# EAGLE design main (EAGLE 9.6.2)
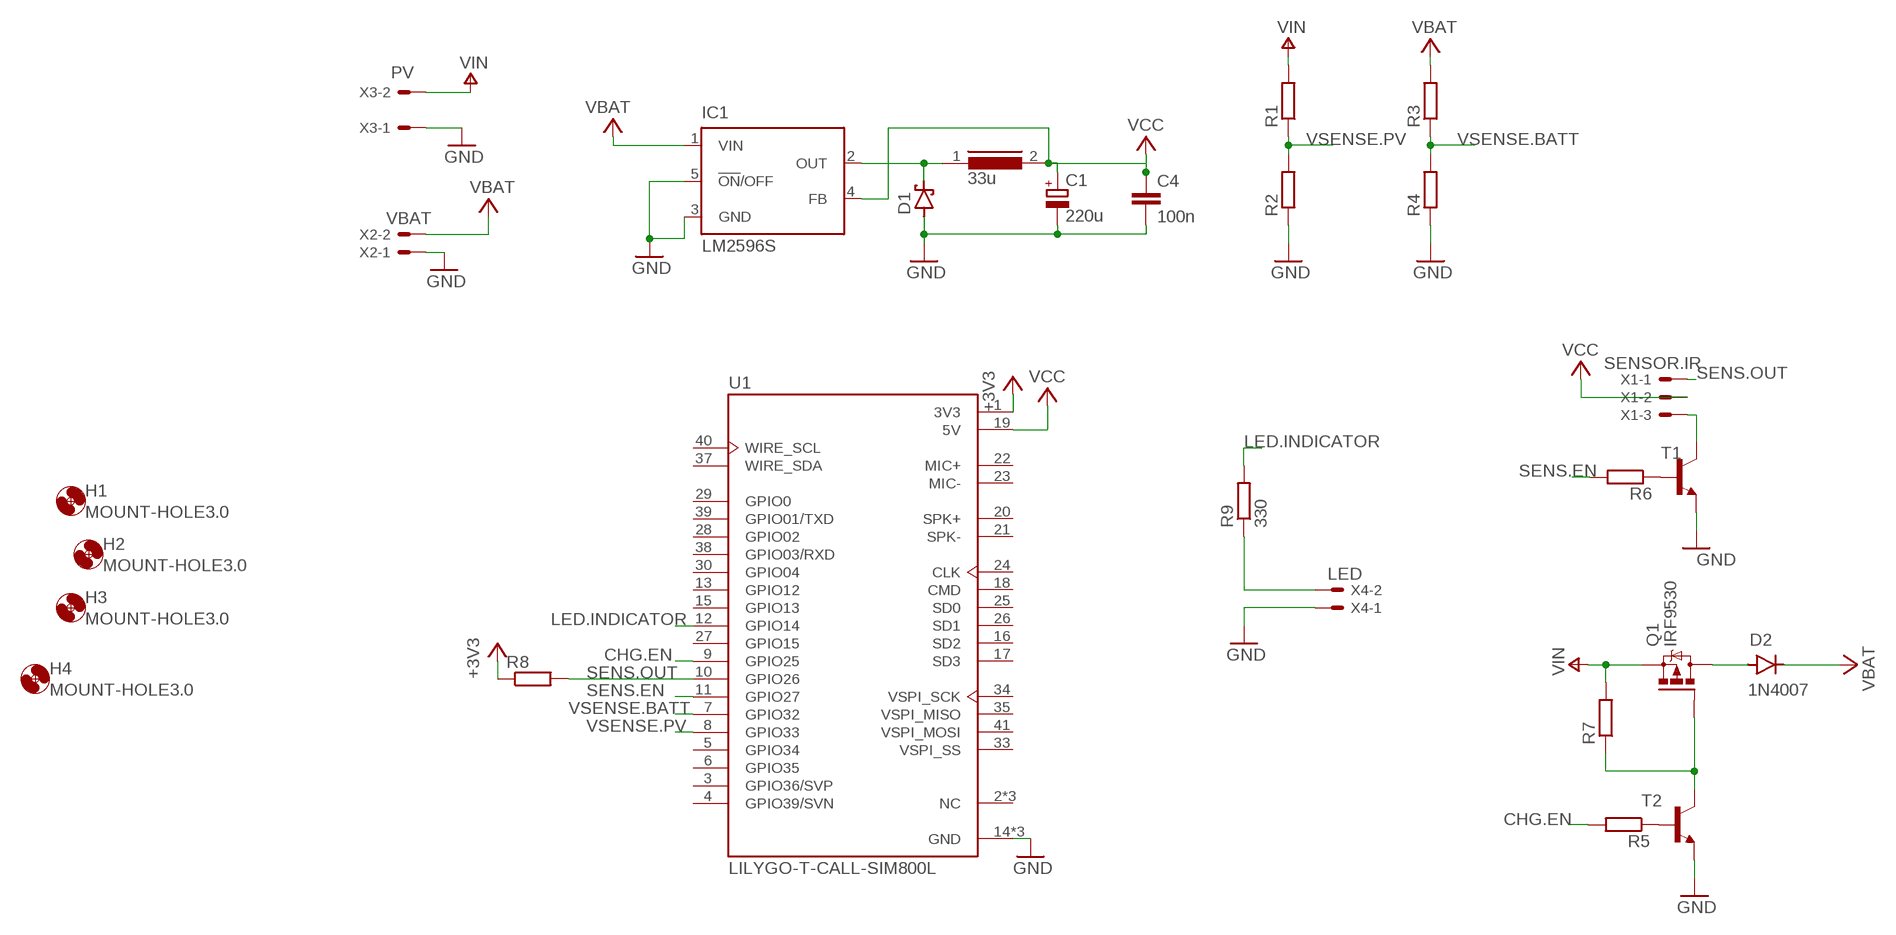
[diagram p0: schematic, sheet 1]

## Parts
C1  220u  CPOL-EU153CLV-0810  [153CLV-0810]
C4  100n  C-EUC0805  [C0805]
D1  SCHOTTKY-DIODESMD  [SMB]
D2  1N4007  [DO-41]
H1  MOUNT-HOLE3.0  [3,0]
H2  MOUNT-HOLE3.0  [3,0]
H3  MOUNT-HOLE3.0  [3,0]
H4  MOUNT-HOLE3.0  [3,0]
IC1  LM2596S  [TO263-5]
L2  33u  DR125  [DR125]
Q1  IRF9530  [TO220BV]
R1  R-EU_R0805  [R0805]
R2  R-EU_R0805  [R0805]
R3  R-EU_R0805  [R0805]
R4  R-EU_R0805  [R0805]
R5  R-EU_0207/7  [0207/7]
R6  R-EU_0207/7  [0207/7]
R7  R-EU_0207/7  [0207/7]
R8  R-EU_R0805  [R0805]
R9  330  R-EU_R0805  [R0805]
T1  -NPN-TO92-ECB  [TO92-ECB]
T2  -NPN-TO92-ECB  [TO92-ECB]
U1  LILYGO-T-CALL-SIM800L  [XCVR_LILYGO-T-CALL-SIM800L]
X1  SENSOR.IR  JST-XH-03-PIN-LONG-PAD  [JST-XH-03-PACKAGE-LONG-PAD]
X2  VBAT  JST-XH-02-PIN-LONG-PAD  [JST-XH-02-PACKAGE-LONG-PAD]
X3  PV  KK-156-2  [KK-156-2]
X4  LED  JST-XH-02-PIN-LONG-PAD  [JST-XH-02-PACKAGE-LONG-PAD]

## Nets
+3V3: R8.1 U1.1(3V3)
+5V: D2.C IC1.1(VIN) R3.2 X2.2 ; supply symbol labelled VBAT
CHG.EN: R5.2 U1.9(GPIO25)
GND: C1.- C4.2 D1.A IC1.3(GND) IC1.5(!ON!/OFF) R2.1 R4.1 T1.E T2.E U1.14(GND) U1.36(GND) U1.42(GND) X2.1 X3.1 X4.1
LED.INDICATOR: R9.2 U1.12(GPIO14)
N$4: T1.C X1.3
N$5: R6.1 T1.B
N$8: R9.1 X4.2
N$9: D1.C IC1.2(OUT) L2.1
N$14: Q1.G R7.1 T2.C
N$19: D2.A Q1.D
N$20: R5.1 T2.B
SENS.EN: R6.2 U1.11(GPIO27)
SENS.OUT: R8.2 U1.10(GPIO26) X1.1
V+: Q1.S R1.2 R7.2 X3.2 ; supply symbol labelled VIN
VCC: C1.+ C4.1 IC1.4(FB) L2.2 U1.19(5V) X1.2
VSENSE.BATT: R3.1 R4.2 U1.7(GPIO32)
VSENSE.PV: R1.1 R2.2 U1.8(GPIO33)
Unconnected: U1.3(GPIO36/SVP) U1.4(GPIO39/SVN) U1.5(GPIO34) U1.6(GPIO35) U1.13(GPIO12) U1.15(GPIO13) U1.16(SD2) U1.17(SD3) U1.18(CMD) U1.24(CLK) U1.25(SD0) U1.26(SD1) U1.27(GPIO15) U1.28(GPIO02) U1.29(GPIO0) U1.30(GPIO04) U1.33(VSPI_SS) U1.34(VSPI_SCK) U1.35(VSPI_MISO) U1.37(WIRE_SDA) U1.38(GPIO03/RXD) U1.39(GPIO01/TXD) U1.40(WIRE_SCL) U1.41(VSPI_MOSI)

## Power pins joined to a net without a drawn wire
MIC+: U1.22(MIC+)
MIC-: U1.23(MIC-)
NC: U1.2(NC) U1.31(NC) U1.32(NC)
SPK+: U1.20(SPK+)
SPK-: U1.21(SPK-)

## Library data of the parts
C1 = rcl:CPOL-EU: POLARIZED CAPACITOR, European symbol; SPICEPREFIX: C
C4 = rcl:C-EU: CAPACITOR, European symbol; SPICEPREFIX: C
D1 = diode:SCHOTTKY-DIODE: Schottky Diode
D2 = Diodes:1N4007: DIODE GEN PURP 1KV 1A DO41 Manufacturer's datasheet <https://www.mccsemi.com/pdf/Products/1N4001-1N4007(DO-41).pdf>; CREATED_BY: PCBLayout.com; DIGIKEY_PART_NUMBER: 1N4007MSCT-ND; MANUFACTURER: Micro Commercial Co; MPN: 1N4007; PACKAGE: DO-41
H1-H4 = holes:MOUNT-HOLE: MOUNTING HOLE with drill center marker
IC1 = national-semiconductor:LM2596: SIMPLE SWITCHER® Power Converter 150 kHz 3A Step-Down Voltage Regulator Source: http://www.national.com/ds/LM/LM2596.pdf; MF: NATIONAL SEMICONDUCTOR; MPN: LM2596S-ADJ/NOPB; OC_FARNELL: 9494367; OC_NEWARK: 41K3842
L2 = DR125:DR125: High Power Density, High Efficiency, Shielded Inductors Source: coiltronics_dr_series.pdf; SPICEPREFIX: L
Q1 = transistor-power:IRF9530: P-CHANNEL HEXFET POWER-MOS-FET Source: http://www.irf.com/product-info/datasheets/data/irf9530.pdf
R1-R9 = rcl:R-EU_: RESISTOR, European symbol; SPICEPREFIX: R
T1 T2 = transistor:*-NPN-: NPN Transistror BF959 corrected 2008.03.06
U1 = LILYGO-T-CALL-SIM800L:LILYGO-T-CALL-SIM800L: ESP32 Wireless Module GPRS Antenna SIM Card SIM800L Module Check availability <https://pricing.snapeda.com/parts/LilyGo-T-Call-SIM800L/LILYGO/view-part?ref=eda>; AVAILABILITY: Not in stock; DESCRIPTION: ESP32 Wireless Module GPRS Antenna SIM Card SIM800L Module; MF: LILYGO; MP: LilyGo-T-Call-SIM800L; PACKAGE: Package; PRICE: None
X1 = Rembrandt Electronics - JST XH Connectors v1-0-2-2-2-2:JST-XH-03-PIN: JST XH Connector 2 Pin Wire to board connector. Pitch: 2,54 mm, (0.100") Number of pins: 3 Created by Rembrandt Electronics www.rembrandtelectronics.com
X2 X4 = Rembrandt Electronics - JST XH Connectors v1-0-2-2-2-2:JST-XH-02-PIN: JST XH Connector 2 Pin Wire to board connector. Pitch: 2,54 mm, (0.100") Number of pins: 2 Created by Rembrandt Electronics www.rembrandtelectronics.com
X3 = con-molex:KK-156-2: KK 156 HEADER Source: http://www.molex.com/pdm_docs/sd/026604100_sd.pdf; MF: MOLEX; OC_FARNELL: unknown; OC_NEWARK: unknown

## Board
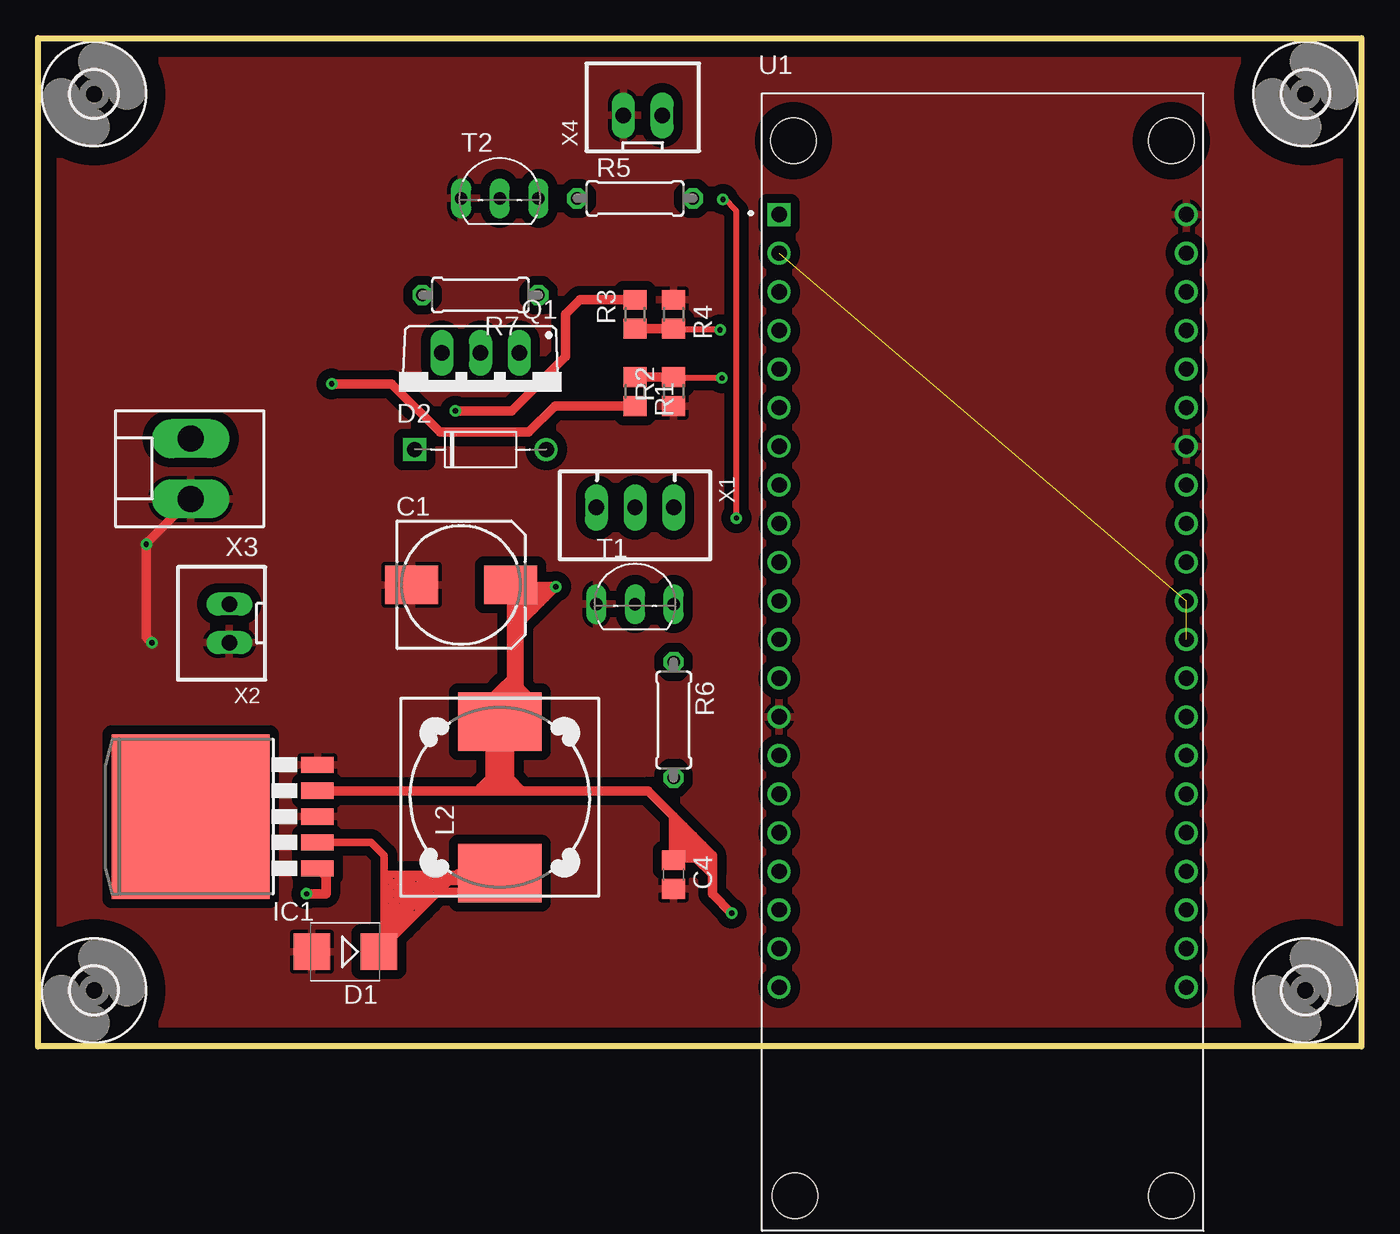
[diagram p1: board, top side]
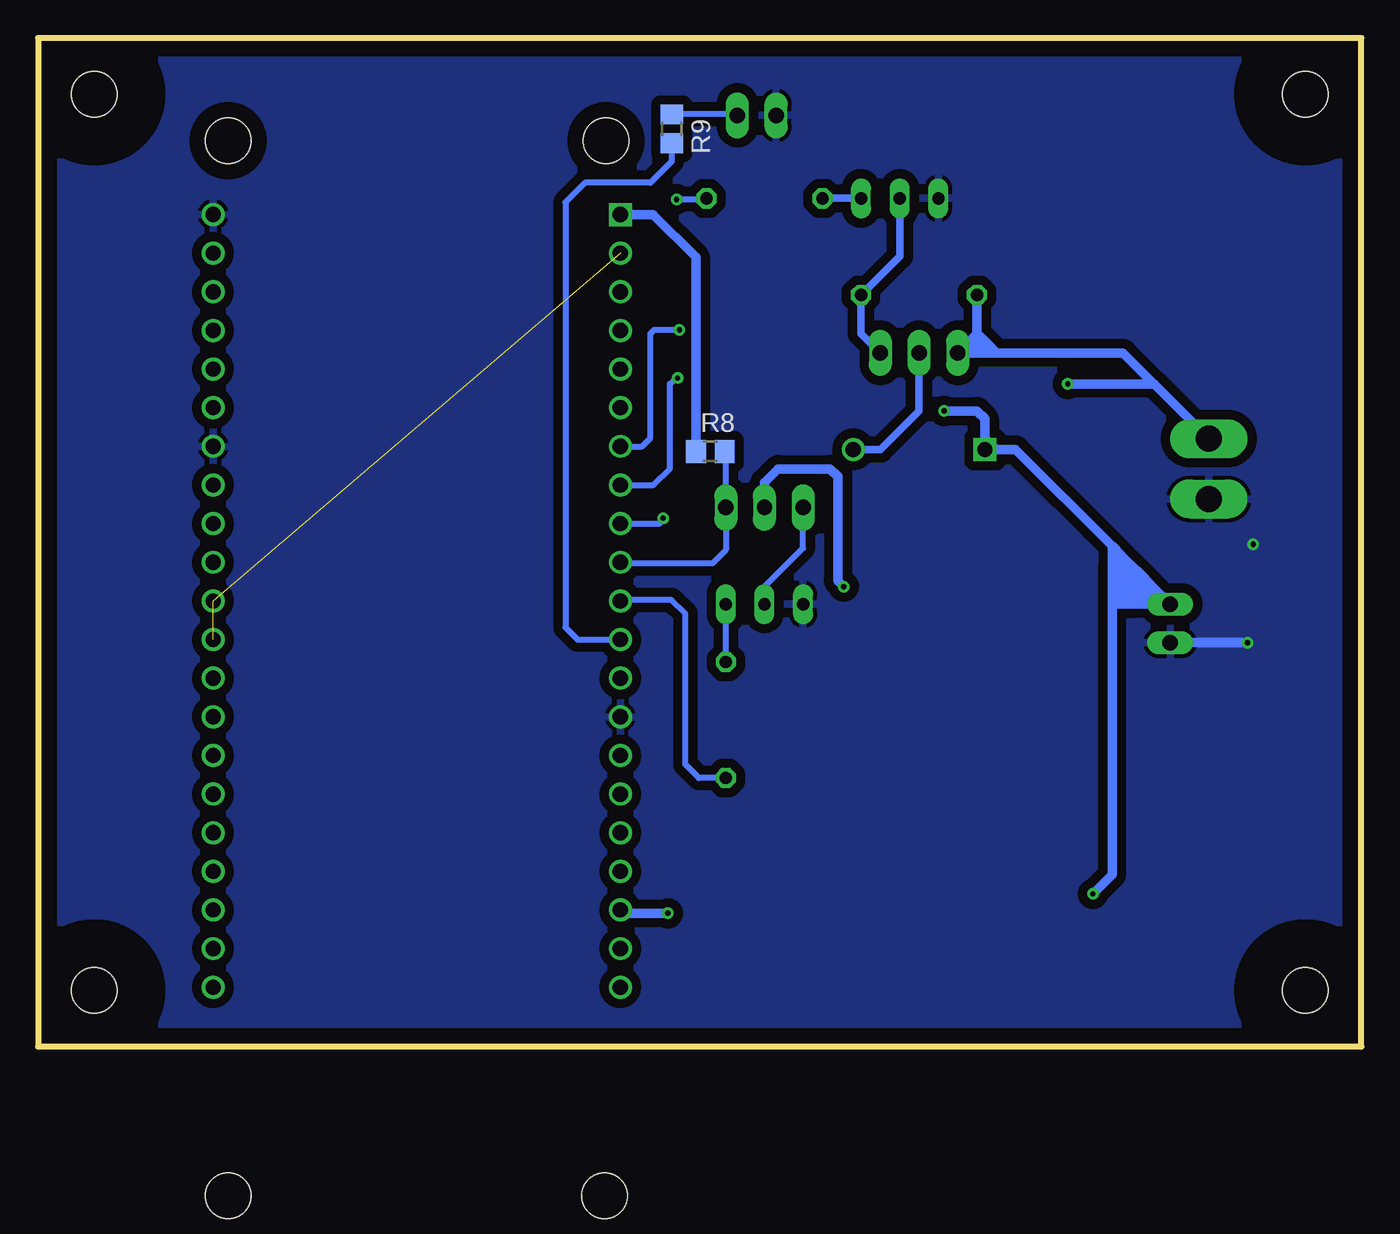
[diagram p2: board, bottom side, seen from below]

Size 87 x 66.29 mm. Coordinates in mm from the lower left corner, seen from the top.
Outline: 0,0 0,66.29 87,66.29 87,0 0,0
Copper layers (1*16): Top 0.035mm / dielectric 1.5mm / Bottom 0.035mm
Design rules "default": minimum track width 6mil, minimum drill 0.35mm, track to track 6mil, track to pad 6mil, pad to pad 6mil, via to via 6mil, smd to smd 6mil, copper to edge 40mil, drill to drill 6mil, minimum pad ring 10mil, minimum via ring 8mil, stop-mask expansion 4mil, vias tented up to drill 0mil, thermal gap 10mil

### Footprints (pad centres in the part's own frame; a part is rotated, then mirrored left to right if it is on the bottom)
153CLV-0810 = smd 3.5 x 2.5: + 3.25,0; - -3.25,0
C0805 = smd 1.3 x 1.5: 1 -0.95,0; 2 0.95,0
SMB = smd 2.4 x 2.4: A 2.2,0; C -2.2,0
DO-41 = drill 1: A 4.325,0 | drill 1 square: C -4.325,0
3,0 = hole 3: 0,0
TO263-5 = smd 1.067 x 2.159: 1 -3.404,-5.791; 2 -1.702,-5.791; 3 0,-5.791; 4 1.702,-5.791; 5 3.404,-5.791 | smd 10.8 x 10.41: 6 0,2.54
DR125 = smd 3.85 x 5.5: 1 -4.975,0; 2 4.975,0
TO220BV = drill 1.016 long: D 0,-2.54; G -2.54,-2.54; S 2.54,-2.54
R0805 = smd 1.3 x 1.5: 1 -0.95,0; 2 0.95,0
0207/7 = drill 0.813 octagon: 1 -3.81,0; 2 3.81,0
TO92-ECB = drill 0.813 long: B 2.54,0; C 0,0; E -2.54,0
XCVR_LILYGO-T-CALL-SIM800L = drill 1 square: 1 -13.385,29.42 | drill 1: 2 -13.385,26.88; 3 -13.385,24.34; 4 -13.385,21.8; 5 -13.385,19.26; 6 -13.385,16.72; 7 -13.385,14.18; 8 -13.385,11.64; 9 -13.385,9.1; 10 -13.385,6.56; 11 -13.385,4.02; 12 -13.385,1.48; 13 -13.385,-1.06; 14 -13.385,-3.6; 15 -13.385,-6.14; 16 -13.385,-8.68; 17 -13.385,-11.22; 18 -13.385,-13.76; 19 -13.385,-16.3; 20 -13.385,-18.84; 21 -13.385,-21.38; 22 13.385,-21.38; 23 13.385,-18.84; 24 13.385,-16.3; 25 13.385,-13.76; 26 13.385,-11.22; 27 13.385,-8.68; 28 13.385,-6.14; 29 13.385,-3.6; 30 13.385,-1.06; 31 13.385,1.48; 32 13.385,4.02; 33 13.385,6.56; 34 13.385,9.1; 35 13.385,11.64; 36 13.385,14.18; 37 13.385,16.72; 38 13.385,19.26; 39 13.385,21.8; 40 13.385,24.34; 41 13.385,26.88; 42 13.385,29.42 | hole 3: -12.355,-35.09; 12.395,-35.09; -12.445,34.27; 12.395,34.27
JST-XH-03-PACKAGE-LONG-PAD = drill 1.016 long: 1 -2.54,0; 2 0,0; 3 2.54,0
JST-XH-02-PACKAGE-LONG-PAD = drill 1.016 long: 1 -1.27,0; 2 1.27,0
KK-156-2 = drill 1.7 pad 2.184 long: 1 -1.98,0; 2 1.98,0

### Placement (x,y rotation side)
C1  27.81,30.35 0 top
C4  41.78,11.3 270 top
D1  20.19,6.22 180 top
D2  29.08,39.24 0 top
H1  3.68,3.68 0 top
H2  3.68,62.61 0 top
H3  83.31,3.68 0 top
H4  83.31,62.61 0 top
IC1  12.57,15.11 90 top
L2  30.35,16.38 90 top
Q1  29.08,43.05 180 top
R1  39.24,43.05 270 top
R2  41.78,43.05 90 top
R3  39.24,48.13 90 top
R4  41.78,48.13 270 top
R5  39.24,55.75 0 top
R6  41.78,21.46 270 top
R7  29.08,49.4 180 top
R8  42.8,39.12 0 bottom
R9  45.34,60.33 270 bottom
T1  39.24,29.08 0 top
T2  30.35,55.75 0 top
U1  62.1,25.27 0 top
X1  39.24,35.43 180 top
X2  12.57,27.81 90 top
X3  10.03,37.97 90 top
X4  39.75,61.21 0 top

### Tracks (layer width: path | path; a pad name or v marks a point on that pad's centre or on a via)
+3V3
  Bottom 0.61: U1.1 46.56,54.69 43.75,51.88 R8.1
+5V  (via drill 0.35)
  Top 0.61: IC1.1 18.92,11.15 18.92,10.03 v17.65,10.03 | v27.43,41.78 31.12,41.78 34.67,45.34 34.67,48.13 35.62,49.08 R3.2
  Bottom 0.61: 15.11,31.62 15.75,32.26 | 15.75,32.26 16.38,32.89 | 16.38,32.89 22.73,39.24 24,39.24 | 24,39.24 D2.C 24.76,40 | v27.43,41.78 25.27,41.78 24.76,41.27 24.76,40 | v17.65,10.03 16.38,11.3 16.38,29.08 | 16.38,29.08 16.38,30.35 | 16.38,30.35 16.38,31.62 | 16.38,32.89 16.38,31.62 | 16.38,31.62 15.11,31.62 | 16.38,31.62 15.75,32.26 | 13.84,29.08 15.11,29.08 | 15.11,29.08 16.38,30.35 | 15.11,29.08 16.38,29.08 | 13.84,29.08 14.48,29.72 | 14.48,29.72 15.11,30.35 | 15.75,30.99 15.11,30.35 | 16.38,31.62 15.75,30.99 | 13.84,30.35 14.48,30.99 | 14.48,30.99 15.11,31.62 | 13.84,30.35 15.11,30.35 | 14.48,30.99 15.11,30.35 | 15.11,31.62 15.11,30.35 | 15.11,31.62 15.75,30.99 | 15.75,30.99 16.38,30.35 | 15.11,30.35 16.38,30.35 | 15.11,30.35 16.38,29.08 | 15.11,30.35 15.11,29.08 | 14.48,29.72 15.11,29.08 | 13.84,30.35 14.48,29.72 | 13.84,30.35 13.84,29.08 | 13.84,29.08 X2.2 13.84,30.35 | 24,39.24 24.76,40
CHG.EN  (via drill 0.35)
  Top 0.406: v45.91,34.73 45.91,54.93 45.09,55.75 v45.02,55.69
  Bottom 0.406: U1.9 46.14,34.37 45.85,34.67 v45.91,34.73 | v45.02,55.69 43.12,55.69 R5.2
GND  (via drill 0.35)
  Top 0.61: X3.1 7.11,33.07 v7.11,33.02 7.11,26.92 v7.49,26.54
  Bottom 0.61: X2.1 v7.49,26.54
  pour Bottom (isolate 0.61): 0.25,66.42 87,66.42 87,0 0.25,0
  pour Top (isolate 0.61): 0,66.29 0,0 87,0 87,66.29
LED.INDICATOR
  Bottom 0.406: R9.2 45.34,58.17 46.74,56.77 51.05,56.77 52.32,55.5 52.32,27.56 51.52,26.75 U1.12
N$4
  Bottom 0.406: T1.C 39.24,30.23 36.7,32.77 X1.3
N$5
  Bottom 0.406: R6.1 T1.B
N$8
  Bottom 0.406: X4.2 41.08,61.27 R9.1
N$9
  Top 0.508: IC1.2 21.89,13.41 22.73,12.57 22.73,11.3 | 22.73,7.49 22.73,6.56 D1.C | 22.73,7.49 22.73,8.76 | 26.54,10.37 27.01,10.84 | 27.47,11.3 27.58,11.41 L2.1 | L2.1 30.25,11.3 29.08,11.3 | 29.08,11.3 27.47,11.3 | 27.47,11.3 26.54,11.3 | 26.54,11.3 25.27,11.3 | 24,11.3 22.73,11.3 | 24,11.3 25.27,11.3 | 24,7.83 24.47,8.3 | 24.47,8.3 25.1,8.93 | 25.27,9.1 25.74,9.57 | 25.74,9.57 26.37,10.2 | 27.01,10.84 26.54,11.3 | 26.37,11.13 26.37,10.2 | 26.37,11.13 26.54,11.3 | 26.54,10.37 26.37,10.2 | 26.54,10.37 26.54,11.3 | 25.91,10.67 25.74,10.84 | 25.91,10.67 26.37,10.2 | 26.37,11.13 25.91,10.67 | 25.27,11.3 25.74,10.84 | 25.74,10.84 25.74,9.57 | 25.27,11.3 25.27,10.03 | 25.27,9.1 25.27,10.03 | 25.27,9.1 25.1,8.93 | 25.1,8.93 25.1,11.13 | D1.C 24,7.83 | 24,7.83 24,8.76 | 24,10.03 24,8.76 | 24,10.03 24,11.3 | 24.47,8.3 24.47,9.57 | 24.47,10.84 24,11.3 | 25.1,8.93 24.47,9.57 | 24.47,9.57 24.47,9.91 | 24.47,10.03 24.47,10.84 | 25.27,9.1 24.47,9.91 | 24.47,9.91 24.47,10.03 | 25.27,10.03 24.47,10.03 | 25.27,10.03 24.47,10.84 | 25.1,11.13 25.27,11.3 | 24.47,10.84 24.76,11.13 25.1,11.13 | 24,11.3 23.37,10.67 | 23.37,10.67 22.73,10.03 | 24,10.03 23.37,9.4 | 23.37,9.4 22.73,8.76 | 24,10.03 23.37,10.67 | 24,10.03 22.73,10.03 | 22.73,8.76 22.73,10.03 | 22.73,10.03 22.73,11.3 | 22.73,11.3 23.37,10.67 | 22.73,10.03 23.37,9.4 | 23.07,8.76 24,8.76 | 22.73,8.76 23.07,8.76 | 23.07,8.76 23.37,8.47 | 24,7.83 23.54,8.3 | 22.73,7.49 23.07,7.83 | 23.07,7.83 24,7.83 | 23.07,7.83 23.07,6.9 D1.C | 23.07,7.83 23.07,8.76 | D1.C 23.54,7.37 23.54,8.3 | 23.54,8.3 23.37,8.47 | 23.37,8.47 23.37,9.4 | 24,8.76 23.37,9.4 | 23.54,8.3 24,8.76 | 27.01,10.84 27.47,11.3 | L2.1 29.78,10.84 27.01,10.84 | 26.37,10.2 28.91,10.2 29.08,10.03 29.08,11.3
N$14
  Bottom 0.508: Q1.G 32.89,46.86 R7.1 30.35,51.94 T2.C
N$19
  Bottom 0.508: D2.A 31.62,39.24 29.08,41.78 Q1.D
N$20
  Bottom 0.508: T2.B R5.1
NC  (2 unrouted)
SENS.EN
  Bottom 0.406: R6.2 43.56,17.65 44.45,18.54 44.45,28.45 45.34,29.34 48.67,29.34 U1.11
SENS.OUT
  Bottom 0.406: U1.10 48.63,31.75 42.67,31.75 41.78,32.64 X1.1 41.78,39.05 R8.2
V+  (via drill 0.35)
  Top 0.61: v19.3,43.56 23.24,43.56 26.42,40.39 32.26,40.39 33.97,42.1 R1.2
  Bottom 0.61: 24,45.59 25.27,45.59 | 25.27,45.59 Q1.S 25.91,46.23 | R7.2 25.27,46.86 | 25.27,46.86 25.91,46.23 | 25.27,46.86 25.27,45.59 | 25.91,46.23 25.27,45.59 | 25.27,46.86 24.64,46.23 | 24.64,46.23 24,45.59 | 24.64,46.23 25.27,45.59 | X3.2 13.62,43.54 13.64,43.56 | 13.64,43.56 15.67,45.59 24,45.59 | 13.64,43.56 v19.3,43.56
VCC  (via drill 0.35)
  Top 0.508: L2.2 30.41,21.41 31.06,20.75 31.06,21.21 31.06,21.36 | C1.+ 31.06,24.21 | 31.06,24.21 31.06,22.99 | L2.2 30.35,20.96 | 31.62,24.26 31.62,23.5 | 31.62,22.99 31.06,22.99 | 31.62,22.99 31.62,21.36 L2.2 | L2.2 31.06,21.36 | 31.06,21.36 31.06,22.99 | 31.62,22.99 31.62,23.5 | L2.2 30.35,22.86 30.23,22.73 29.59,22.73 30.35,23.5 | 30.35,23.5 31.62,23.5 | 30.35,23.5 31.06,24.21
  Top 0.61: IC1.4 29.08,16.82 | 29.08,16.82 29.52,16.82 | 29.52,16.82 29.72,17.02 | 29.72,17.02 30.35,17.65 | 30.35,20.96 30.35,18.92 | 30.35,18.29 30.35,17.65 | 29.52,16.82 30.35,16.82 | 30.35,16.82 31.19,16.82 | 31.19,16.82 31.83,16.82 | 31.83,16.82 40.08,16.82 41.78,15.11 | 41.78,15.11 42.42,14.48 | 42.42,14.48 43.05,13.84 | 30.35,17.65 30.99,17.02 | 30.99,17.02 31.19,16.82 | 30.35,17.65 30.35,16.82 | 29.72,19.56 29.72,18.92 | 29.72,18.92 29.72,17.65 | 29.72,17.65 29.72,17.02 | 30.99,19.56 30.99,18.92 | 30.99,18.92 30.99,17.65 | 30.99,17.02 30.99,17.65 | 30.99,17.65 30.35,17.65 | 30.99,17.65 30.04,18.61 | 30.35,17.65 29.72,17.65 | 29.72,17.65 30.35,18.29 | 30.35,18.29 30.35,18.92 | 30.04,18.61 30.35,18.92 | 30.35,18.92 30.99,18.92 | 30.35,18.29 30.99,18.92 | 30.35,18.92 30.99,19.56 | 30.99,19.56 30.99,20.72 L2.2 29.72,20.72 29.72,19.56 | 30.04,18.61 29.72,18.92 | 30.35,18.92 29.72,18.92 | 30.35,18.92 29.72,19.56 | 29.08,16.82 29.08,17.02 29.72,17.65 | 30.99,17.65 31.83,16.82 | 31.62,28.7 31.62,29.79 C1.+ 31.19,30.23 33.15,30.23 | 31.62,28.45 31.62,27.81 | 31.62,27.81 31.62,24.26 31.62,23.62 32.64,22.61 31.24,21.21 31.06,21.21 | 41.78,15.11 41.78,13.84 | 42.1,12.57 43.05,12.57 | 43.05,13.52 43.05,12.57 | 43.05,13.84 43.05,13.52 | 43.05,13.52 42.1,12.57 | 43.05,13.84 42.73,13.84 | 42.42,14.48 41.78,13.84 | 41.78,13.84 41.78,12.89 | 41.78,12.89 42.1,12.57 | 43.05,13.52 42.73,13.84 | 42.73,13.84 41.78,13.84 | 41.78,12.89 C4.1 41.94,12.41 | 41.78,12.89 42.73,13.84 | v45.59,8.76 44.32,10.03 44.32,11.3 | 43.05,13.84 43.69,13.21 | 43.69,13.21 44.32,12.57 | 41.94,12.41 42.1,12.57 | 43.05,12.57 44.32,12.57 | 43.69,13.21 43.05,12.57 | 44.32,12.57 44.32,11.3 | 43.21,12.41 43.05,12.57
  Top 0.61: 44.32,11.3 43.21,12.41 | 43.21,12.41 41.94,12.41 | 33.15,30.23 32.77,29.85 | 32.77,29.85 32.32,29.4 | 32.32,29.4 32.13,29.21 | 32.13,29.21 31.62,28.7 | 31.62,28.7 31.62,28.45 | 33.02,29.21 33.34,29.53 | 33.02,29.21 32.64,28.83 | 32.64,28.83 32.26,28.45 | 31.62,28.45 32.26,28.45 | 32.26,28.45 32.13,28.57 32.13,29.21 | 32.64,28.83 32.32,29.15 32.32,29.4 | 33.02,29.21 33.02,29.59 32.77,29.85 | 33.34,29.53 33.34,30.04 33.15,30.23 | 33.15,30.23 v34.04,30.23 33.34,29.53 | 32.26,28.45 31.62,27.81
  Bottom 0.61: U1.19 48.51,8.76 v45.59,8.76 | X1.2 39.24,37.08 38.35,37.97 34.92,37.97 34.42,37.47 34.42,30.61 v34.04,30.23
VSENSE.BATT  (via drill 0.35)
  Top 0.406: v44.83,47.12 41.85,47.12 R4.2
  Top 0.61: R3.1 R4.2
  Bottom 0.406: U1.7 47.29,39.45 46.74,40.01 46.74,46.86 46.48,47.12 v44.83,47.12
VSENSE.PV  (via drill 0.35)
  Top 0.406: v44.96,43.94 41.84,43.94 R2.2
  Top 0.61: R1.1 R2.2
  Bottom 0.406: U1.8 46.53,36.91 45.47,37.97 45.47,43.56 45.09,43.94 v44.96,43.94